# EAGLE design ProbeBoard (EAGLE 9.3.0)

## Sheet 1 of 3: ADC Schematic
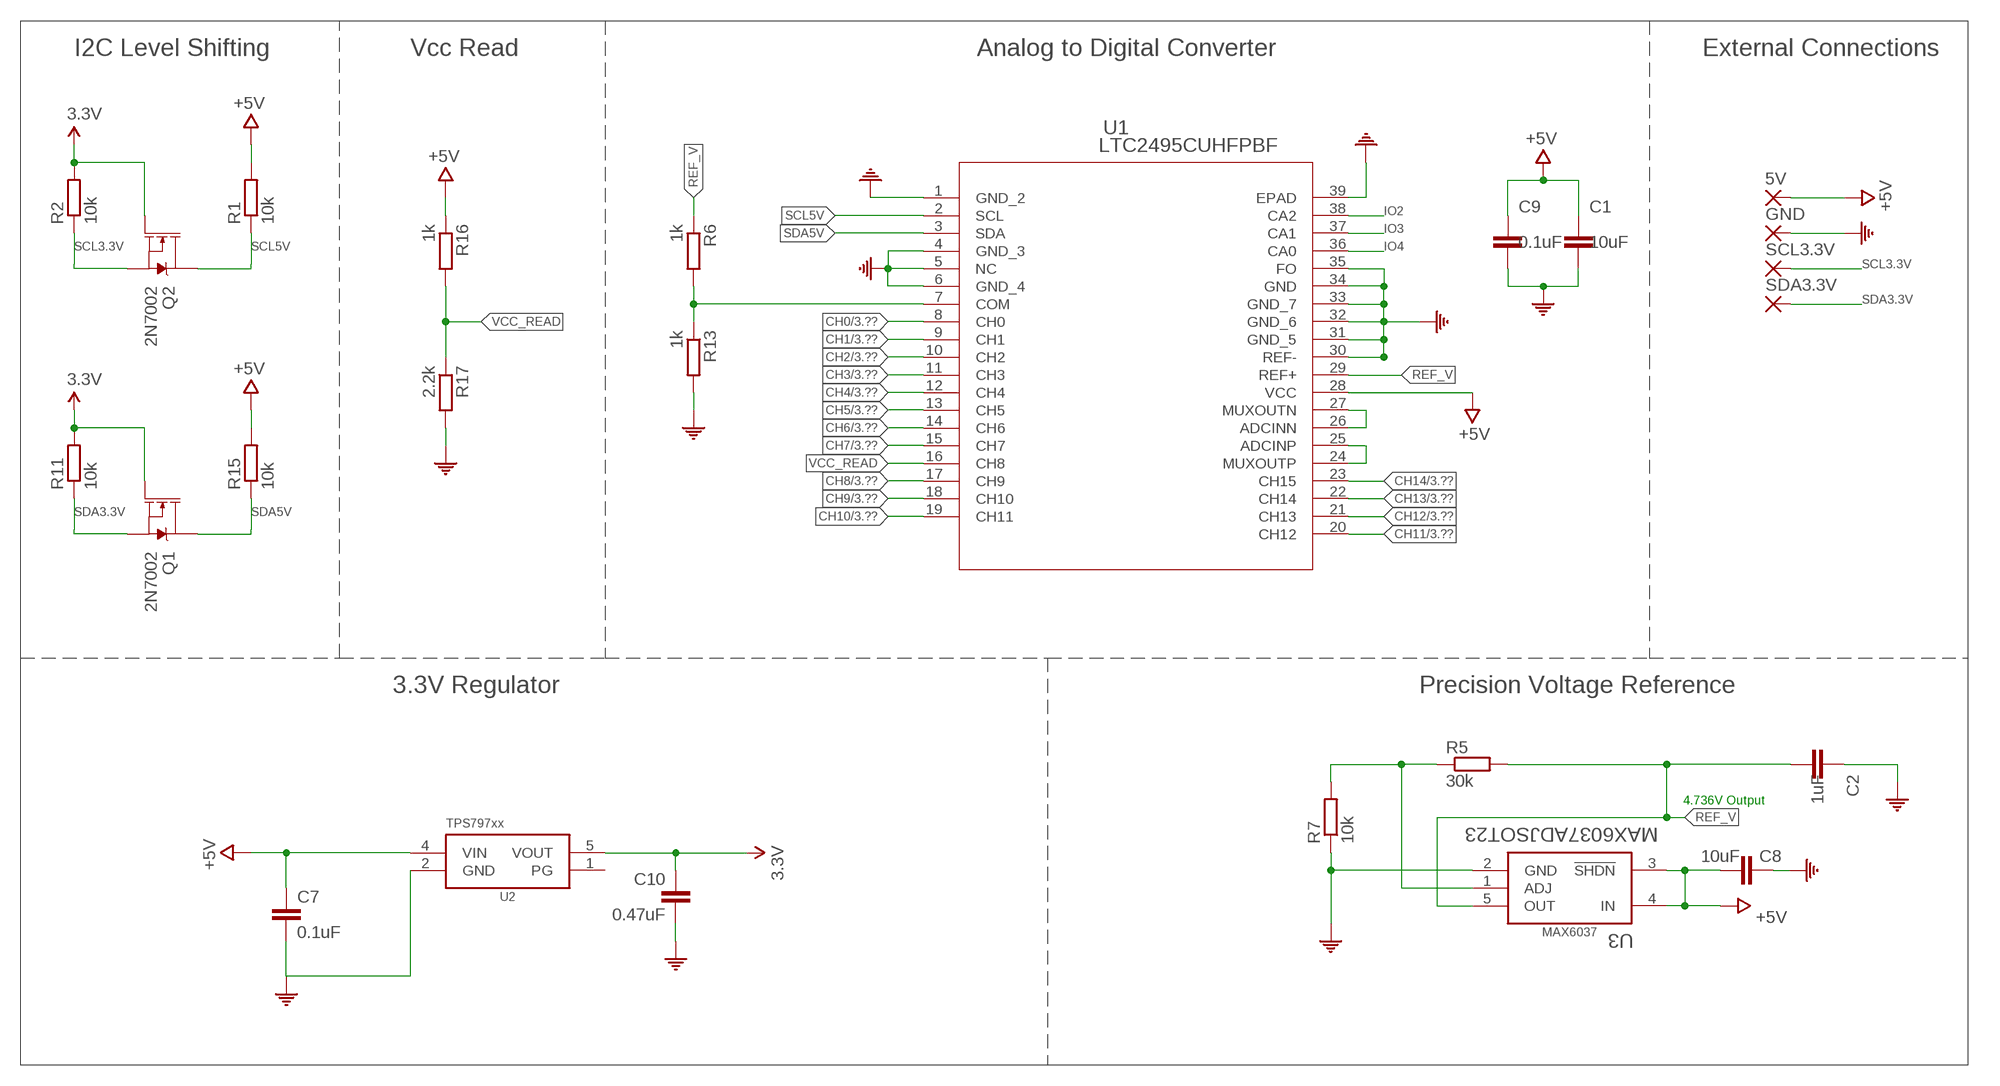
[diagram p0: schematic, sheet 1]

### Parts
5V  1,6/0,9  [1,6/0,9]
C1  10uF  C-EUC0603  [C0603]
C2  1uF  C-EUC0603  [C0603]
C7  0.1uF  C-EUC0603  [C0603]
C8  10uF  C-EUC0603  [C0603]
C9  0.1uF  C-EUC0603  [C0603]
C10  0.47uF  C-EUC0603  [C0603]
GND  1,6/0,9  [1,6/0,9]
Q1  2N7002  MOSFET-NCH-2N7002PW  [SOT323]
Q2  2N7002  MOSFET-NCH-2N7002PW  [SOT323]
R1  10k  R-EU_R0603  [R0603]
R2  10k  R-EU_R0603  [R0603]
R5  30k  R-EU_R0603  [R0603]
R6  1k  R-EU_R0603  [R0603]
R7  10k  R-EU_R0603  [R0603]
R11  10k  R-EU_R0603  [R0603]
R13  1k  R-EU_R0603  [R0603]
R15  10k  R-EU_R0603  [R0603]
R16  1k  R-EU_R0603  [R0603]
R17  2.2k  R-EU_R0603  [R0603]
SCL3.3V  1,6/0,9  [1,6/0,9]
SDA3.3V  1,6/0,9  [1,6/0,9]
U1  LTC2495CUHFPBF  [QFN-38_UHF]
U2  TPS79733  [DCK_R-PDSO-G5]
U3  MAX6037ADJSOT23  [SOT23-5]

### Nets
3.3V: C10.2 Q1.1(G) Q2.1(G) R2.2 R11.2 U2.5(VOUT)
+5V: 5V.1(P) C1.1 C7.1 C8.2 C9.1 R1.2 R15.2 R16.1 U1.28(VCC) U2.4(VIN) U3.3(!SHDN) U3.4(IN) ; also sheet 2,3
CH0: U1.8(CH0) ; also sheet 3
CH1: U1.9(CH1) ; also sheet 3
CH2: U1.10(CH2) ; also sheet 3
CH3: U1.11(CH3) ; also sheet 3
CH4: U1.12(CH4) ; also sheet 3
CH5: U1.13(CH5) ; also sheet 3
CH6: U1.14(CH6) ; also sheet 3
CH7: U1.15(CH7) ; also sheet 3
CH8: U1.17(CH9) ; also sheet 3
CH9: U1.18(CH10) ; also sheet 3
CH10: U1.19(CH11) ; also sheet 3
CH11: U1.20(CH12) ; also sheet 3
CH12: U1.21(CH13) ; also sheet 3
CH13: U1.22(CH14) ; also sheet 3
CH14: U1.23(CH15) ; also sheet 3
COM: C1.2 C2.1 C7.2 C8.1 C9.2 C10.1 GND.1(P) R7.1 R13.2 R17.2 U1.1(GND_2) U1.4(GND_3) U1.5(NC) U1.6(GND_4) U1.30(REF-) U1.31(GND_5) U1.32(GND_6) U1.33(GND_7) U1.34(GND) U1.35(FO) U1.39(EPAD) U2.2(GND) U3.2(GND) ; also sheet 2,3
IO2: U1.38(CA2) ; also sheet 2
IO3: U1.37(CA1) ; also sheet 2
IO4: U1.36(CA0) ; also sheet 2
N$2: U1.26(ADCINN) U1.27(MUXOUTN)
N$3: U1.24(MUXOUTP) U1.25(ADCINP)
N$5: R6.2 R13.1 U1.7(COM)
N$6: R5.1 R7.2 U3.1(ADJ)
REF_V: C2.2 R5.2 R6.1 U1.29(REF+) U3.5(OUT)
SCL3.3V: Q2.2(S) R2.1 SCL3.3V.1(P)
SCL5V: Q2.3(D) R1.1 U1.2(SCL) ; also sheet 2
SDA3.3V: Q1.2(S) R11.1 SDA3.3V.1(P)
SDA5V: Q1.3(D) R15.1 U1.3(SDA) ; also sheet 2
VCC_READ: R16.2 R17.1 U1.16(CH8)
Unconnected: U2.1(PG)

### Notes on the sheet
- I2C Level Shifting | Vcc Read | Analog to Digital Converter | External Connections
- 3.3V Regulator | Precision Voltage Reference
- 4.736V Output

## Sheet 2 of 3: Arduino Schematic
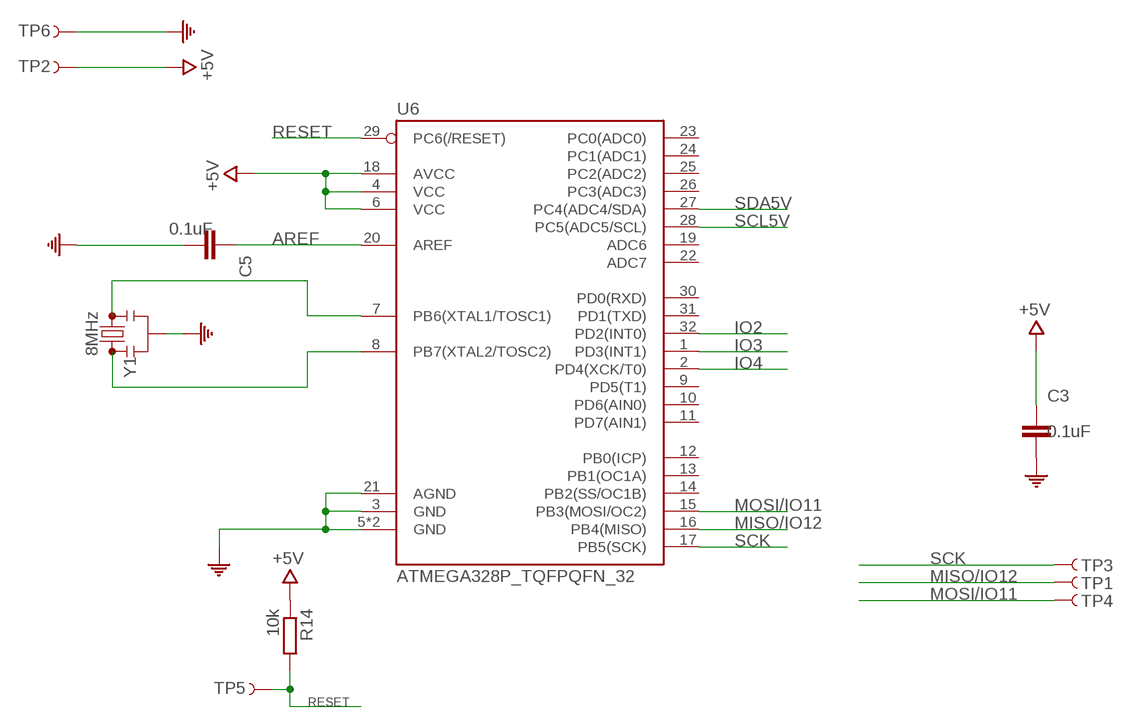
[diagram p1: schematic, sheet 2]

### Parts
C3  0.1uF  C-EUC0603  [C0603]
C5  0.1uF  C-EUC0603  [C0603]
R14  10k  R-EU_R0603  [R0603]
TP1  TEST-POINT3  [PAD.03X.03]
TP2  TEST-POINT3  [PAD.03X.03]
TP3  TEST-POINT3  [PAD.03X.03]
TP4  TEST-POINT3  [PAD.03X.03]
TP5  TEST-POINT3  [PAD.03X.03]
TP6  TEST-POINT3  [PAD.03X.03]
U6  ATMEGA328P_TQFPQFN_32  [QFN32]
Y1  8MHz  RESONATOR8MHZSMD_3.2X1.3  [RESONATOR-SMD-3.2X1.3]

### Nets
+5V: C3.1 R14.1 TP2.P$1 U6.4(VCC) U6.6(VCC) U6.18(AVCC) ; also sheet 1,3
AREF: C5.1 U6.20(AREF)
COM: C3.2 C5.2 TP6.P$1 U6.3(GND) U6.5(GND) U6.21(AGND) U6.EP(GND) Y1.2 ; also sheet 1,3
IO2: U6.32(PD2(INT0)) ; also sheet 1
IO3: U6.1(PD3(INT1)) ; also sheet 1
IO4: U6.2(PD4(XCK/T0)) ; also sheet 1
MISO/IO12: TP1.P$1 U6.16(PB4(MISO))
MOSI/IO11: TP4.P$1 U6.15(PB3(MOSI/OC2))
N$1: U6.7(PB6(XTAL1/TOSC1)) Y1.3
N$7: U6.8(PB7(XTAL2/TOSC2)) Y1.1
RESET: R14.2 TP5.P$1 U6.29(PC6(/RESET))
SCK: TP3.P$1 U6.17(PB5(SCK))
SCL5V: U6.28(PC5(ADC5/SCL)) ; also sheet 1
SDA5V: U6.27(PC4(ADC4/SDA)) ; also sheet 1
Unconnected: U6.9(PD5(T1)) U6.10(PD6(AIN0)) U6.11(PD7(AIN1)) U6.12(PB0(ICP)) U6.13(PB1(OC1A)) U6.14(PB2(SS/OC1B)) U6.19(ADC6) U6.22(ADC7) U6.23(PC0(ADC0)) U6.24(PC1(ADC1)) U6.25(PC2(ADC2)) U6.26(PC3(ADC3)) U6.30(PD0(RXD)) U6.31(PD1(TXD))

## Sheet 3 of 3: Thermistor Connections
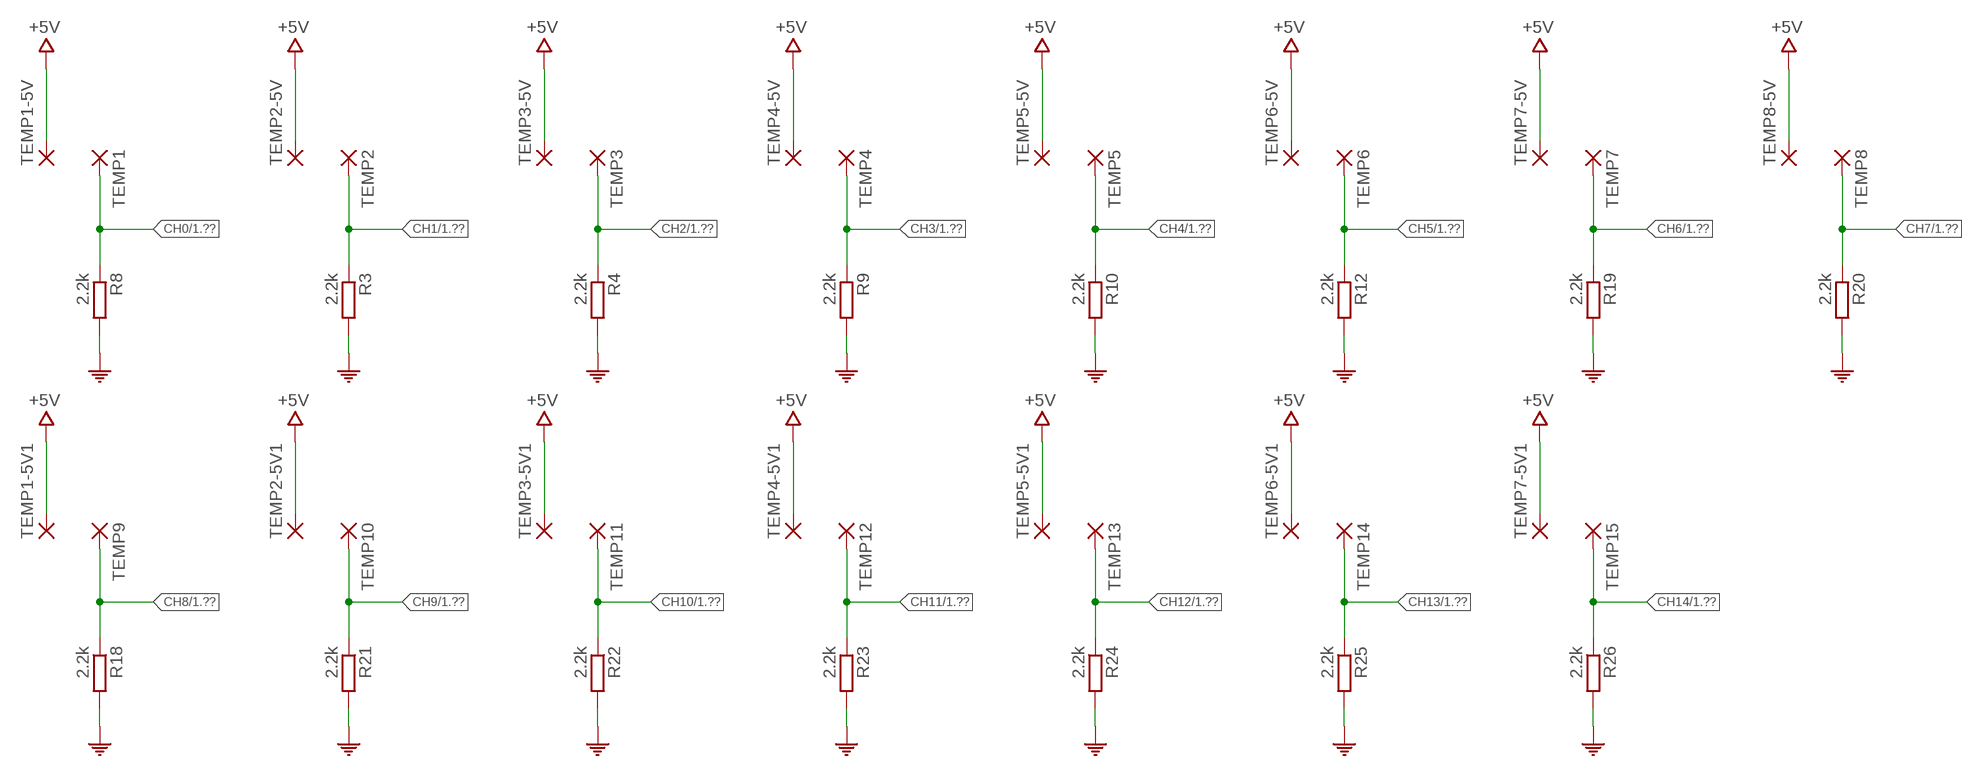
[diagram p2: schematic, sheet 3]

### Parts
R3  2.2k  R-EU_R0603  [R0603]
R4  2.2k  R-EU_R0603  [R0603]
R8  2.2k  R-EU_R0603  [R0603]
R9  2.2k  R-EU_R0603  [R0603]
R10  2.2k  R-EU_R0603  [R0603]
R12  2.2k  R-EU_R0603  [R0603]
R18  2.2k  R-EU_R0603  [R0603]
R19  2.2k  R-EU_R0603  [R0603]
R20  2.2k  R-EU_R0603  [R0603]
R21  2.2k  R-EU_R0603  [R0603]
R22  2.2k  R-EU_R0603  [R0603]
R23  2.2k  R-EU_R0603  [R0603]
R24  2.2k  R-EU_R0603  [R0603]
R25  2.2k  R-EU_R0603  [R0603]
R26  2.2k  R-EU_R0603  [R0603]
TEMP1  1,6/0,9  [1,6/0,9]
TEMP1-5V  1,6/0,9  [1,6/0,9]
TEMP1-5V1  1,6/0,9  [1,6/0,9]
TEMP2  1,6/0,9  [1,6/0,9]
TEMP2-5V  1,6/0,9  [1,6/0,9]
TEMP2-5V1  1,6/0,9  [1,6/0,9]
TEMP3  1,6/0,9  [1,6/0,9]
TEMP3-5V  1,6/0,9  [1,6/0,9]
TEMP3-5V1  1,6/0,9  [1,6/0,9]
TEMP4  1,6/0,9  [1,6/0,9]
TEMP4-5V  1,6/0,9  [1,6/0,9]
TEMP4-5V1  1,6/0,9  [1,6/0,9]
TEMP5  1,6/0,9  [1,6/0,9]
TEMP5-5V  1,6/0,9  [1,6/0,9]
TEMP5-5V1  1,6/0,9  [1,6/0,9]
TEMP6  1,6/0,9  [1,6/0,9]
TEMP6-5V  1,6/0,9  [1,6/0,9]
TEMP6-5V1  1,6/0,9  [1,6/0,9]
TEMP7  1,6/0,9  [1,6/0,9]
TEMP7-5V  1,6/0,9  [1,6/0,9]
TEMP7-5V1  1,6/0,9  [1,6/0,9]
TEMP8  1,6/0,9  [1,6/0,9]
TEMP8-5V  1,6/0,9  [1,6/0,9]
TEMP9  1,6/0,9  [1,6/0,9]
TEMP10  1,6/0,9  [1,6/0,9]
TEMP11  1,6/0,9  [1,6/0,9]
TEMP12  1,6/0,9  [1,6/0,9]
TEMP13  1,6/0,9  [1,6/0,9]
TEMP14  1,6/0,9  [1,6/0,9]
TEMP15  1,6/0,9  [1,6/0,9]

### Nets
+5V: TEMP1-5V1.1(P) TEMP1-5V.1(P) TEMP2-5V1.1(P) TEMP2-5V.1(P) TEMP3-5V1.1(P) TEMP3-5V.1(P) TEMP4-5V1.1(P) TEMP4-5V.1(P) TEMP5-5V1.1(P) TEMP5-5V.1(P) TEMP6-5V1.1(P) TEMP6-5V.1(P) TEMP7-5V1.1(P) TEMP7-5V.1(P) TEMP8-5V.1(P) ; also sheet 1,2
CH0: R8.1 TEMP1.1(P) ; also sheet 1
CH1: R3.1 TEMP2.1(P) ; also sheet 1
CH2: R4.1 TEMP3.1(P) ; also sheet 1
CH3: R9.1 TEMP4.1(P) ; also sheet 1
CH4: R10.1 TEMP5.1(P) ; also sheet 1
CH5: R12.1 TEMP6.1(P) ; also sheet 1
CH6: R19.1 TEMP7.1(P) ; also sheet 1
CH7: R20.1 TEMP8.1(P) ; also sheet 1
CH8: R18.1 TEMP9.1(P) ; also sheet 1
CH9: R21.1 TEMP10.1(P) ; also sheet 1
CH10: R22.1 TEMP11.1(P) ; also sheet 1
CH11: R23.1 TEMP12.1(P) ; also sheet 1
CH12: R24.1 TEMP13.1(P) ; also sheet 1
CH13: R25.1 TEMP14.1(P) ; also sheet 1
CH14: R26.1 TEMP15.1(P) ; also sheet 1
COM: R3.2 R4.2 R8.2 R9.2 R10.2 R12.2 R18.2 R19.2 R20.2 R21.2 R22.2 R23.2 R24.2 R25.2 R26.2 ; also sheet 1,2

## Library data of the parts
5V GND SCL3.3V SDA3.3V TEMP1 TEMP1-5V TEMP1-5V1 TEMP2 TEMP2-5V TEMP2-5V1 TEMP3 TEMP3-5V TEMP3-5V1 TEMP4 TEMP4-5V TEMP4-5V1 TEMP5 TEMP5-5V TEMP5-5V1 TEMP6 TEMP6-5V TEMP6-5V1 TEMP7 TEMP7-5V TEMP7-5V1 TEMP8 TEMP8-5V TEMP9-TEMP15 = wirepad:1,6/0,9: THROUGH-HOLE PAD
C1 C8 = bschulz_passives:C-EU: CAPACITOR, European symbol; DIGIKEY_PART_NUMBER: 445-9104-6-ND; MANUFACTURER: TDK Corporation; MANUFACTURER_PART_NUMBER: C1608X7S0J106M080AC; PRICE: 0.18328
C2 = bschulz_passives:C-EU: CAPACITOR, European symbol; DIGIKEY_PART_NUMBER: 1276-1184-6-ND; MANUFACTURER: Samsung Electro-Mechanics; MANUFACTURER_PART_NUMBER: CL10B105KA8NNNC; PRICE: 0.01719
C3 C5 C7 C9 = bschulz_passives:C-EU: CAPACITOR, European symbol; DIGIKEY_PART_NUMBER: 478-7939-2-ND; MANUFACTURER: AVX Corporation; MANUFACTURER_PART_NUMBER: 0603ZC104KAT2A; PRICE: 0.08325
C10 = bschulz_passives:C-EU: CAPACITOR, European symbol; DIGIKEY_PART_NUMBER: 478-10367-1-ND; MANUFACTURER: AVX Corporation; MANUFACTURER_PART_NUMBER: 0603ZC474KAT2A; PRICE: 0.02904
Q1 Q2 = bschulz:MOSFET-NCH: N-channel MOSFETs Voltage controlled devices that allow control of high current outputs. SparkFun Products: SparkFun OpenScale <https://www.sparkfun.com/products/13261> SparkFun Digital Sandbox <https://www.sparkfun.com/products/12651> SparkFun Monster Moto Shield <https://www.sparkfun.com/products/10182> SparkFun MOSFET Power Controller <https://www.sparkfun.com/products/11214>; DIGIKEY: 2N7002W-FDICT-ND; MF: Diodes Incorporated; MPN: 2N7002W-7-F; PROD_ID: TRANS-11151
R1 R2 R7 R11 R14 R15 = bschulz_passives:R-EU_: RESISTOR, European symbol Digikey Parts: Yageo, 0402 <https://www.digikey.com/products/en/resistors/chip-resistor-surface-mount/52?k=&pkeyword=&sf=0&FV=ffec1104%2Cfffc000d%2C1c0002%2C440067%2C1f140000%2Cffe00034%2C400004&quantity=&ColumnSort=0&page=1&stock=1&pageSize=25> Yageo, 0603 <https://www.digikey.com/products/en/resistors/chip-resistor-surface-mount/52?k=&pkeyword=&s=4356&s=47360&sf=0&FV=fffc000d%2C1c0002%2C142c040c%2C1f140000%2Cffe00034&quantity=10&ColumnSort=1000011&page=1&stock=1&pageSize=25> Panasonic, 0603 <https://www.digikey.com/products/en/resistors/chip-resistor-surface-mount/52?k=&pkeyword=&pv252=68&sf=0&FV=ffec373d%2C1c0002%2C142c040c%2C1f140000%2Cffe00034%2C80002%2Cc0001&quantity=&ColumnSort=0&page=1&stock=1&pageSize=25> Panasonic, precision, 0603 <https://www.digikey.com/products/en/resistors/chip-resistor-surface-mount/52?FV=ffec4907%2Cfffc000a%2Cc0172%2C142c040c%2C1f140000%2Cffe00034%2C1c0002&quantity=100&ColumnSort=2085&page=1&stock=1&pageSize=25> Panasonic, 0805 <https://www.digikey.com/products/en/resistors/chip-resistor-surface-mount/52?k=&pkeyword=&pv3=1&sf=0&FV=ffec373d%2C1c0002%2C1f140000%2Cffe00034%2C142c040d&quantity=&ColumnSort=0&page=1&stock=1&pageSize=25> Rohm, current sense <https://www.digikey.com/products/en/resistors/chip-resistor-surface-mount/52?k=&pkeyword=&pv3=1&sf=0&FV=ffecb688%2C1f140000%2Cffe00034%2C1c0002&quantity=&ColumnSort=0&page=1&stock=1&pageSize=25> Vishay, pulse proof automotive <https://www.digikey.com/products/en/resistors/chip-resistor-surface-mount/52?k=&pkeyword=&pv7=2&sf=0&FV=ffec5d6b%2Cffe00034%2C1f140000&quantity=&ColumnSort=0&page=1&stock=1&pageSize=25>; DIGIKEY_PART_NUMBER: P10KGTR-ND; MANUFACTURER: Panasonic Electronic Components; MANUFACTURER_PART_NUMBER: ERJ-3GEYJ103V; MF: Yageo; PRICE: 0.00494
R3 R4 R8-R10 R12 R17-R26 = bschulz_passives:R-EU_: RESISTOR, European symbol Digikey Parts: Yageo, 0402 <https://www.digikey.com/products/en/resistors/chip-resistor-surface-mount/52?k=&pkeyword=&sf=0&FV=ffec1104%2Cfffc000d%2C1c0002%2C440067%2C1f140000%2Cffe00034%2C400004&quantity=&ColumnSort=0&page=1&stock=1&pageSize=25> Yageo, 0603 <https://www.digikey.com/products/en/resistors/chip-resistor-surface-mount/52?k=&pkeyword=&s=4356&s=47360&sf=0&FV=fffc000d%2C1c0002%2C142c040c%2C1f140000%2Cffe00034&quantity=10&ColumnSort=1000011&page=1&stock=1&pageSize=25> Panasonic, 0603 <https://www.digikey.com/products/en/resistors/chip-resistor-surface-mount/52?k=&pkeyword=&pv252=68&sf=0&FV=ffec373d%2C1c0002%2C142c040c%2C1f140000%2Cffe00034%2C80002%2Cc0001&quantity=&ColumnSort=0&page=1&stock=1&pageSize=25> Panasonic, precision, 0603 <https://www.digikey.com/products/en/resistors/chip-resistor-surface-mount/52?FV=ffec4907%2Cfffc000a%2Cc0172%2C142c040c%2C1f140000%2Cffe00034%2C1c0002&quantity=100&ColumnSort=2085&page=1&stock=1&pageSize=25> Panasonic, 0805 <https://www.digikey.com/products/en/resistors/chip-resistor-surface-mount/52?k=&pkeyword=&pv3=1&sf=0&FV=ffec373d%2C1c0002%2C1f140000%2Cffe00034%2C142c040d&quantity=&ColumnSort=0&page=1&stock=1&pageSize=25> Rohm, current sense <https://www.digikey.com/products/en/resistors/chip-resistor-surface-mount/52?k=&pkeyword=&pv3=1&sf=0&FV=ffecb688%2C1f140000%2Cffe00034%2C1c0002&quantity=&ColumnSort=0&page=1&stock=1&pageSize=25> Vishay, pulse proof automotive <https://www.digikey.com/products/en/resistors/chip-resistor-surface-mount/52?k=&pkeyword=&pv7=2&sf=0&FV=ffec5d6b%2Cffe00034%2C1f140000&quantity=&ColumnSort=0&page=1&stock=1&pageSize=25>; DIGIKEY_PART_NUMBER: P2.2KDBTR-ND; MANUFACTURER: Panasonic Electronic Components; MANUFACTURER_PART_NUMBER: ERA-3AEB222V; MF: Yageo; PRICE: 0.03717
R5 = bschulz_passives:R-EU_: RESISTOR, European symbol Digikey Parts: Yageo, 0402 <https://www.digikey.com/products/en/resistors/chip-resistor-surface-mount/52?k=&pkeyword=&sf=0&FV=ffec1104%2Cfffc000d%2C1c0002%2C440067%2C1f140000%2Cffe00034%2C400004&quantity=&ColumnSort=0&page=1&stock=1&pageSize=25> Yageo, 0603 <https://www.digikey.com/products/en/resistors/chip-resistor-surface-mount/52?k=&pkeyword=&s=4356&s=47360&sf=0&FV=fffc000d%2C1c0002%2C142c040c%2C1f140000%2Cffe00034&quantity=10&ColumnSort=1000011&page=1&stock=1&pageSize=25> Panasonic, 0603 <https://www.digikey.com/products/en/resistors/chip-resistor-surface-mount/52?k=&pkeyword=&pv252=68&sf=0&FV=ffec373d%2C1c0002%2C142c040c%2C1f140000%2Cffe00034%2C80002%2Cc0001&quantity=&ColumnSort=0&page=1&stock=1&pageSize=25> Panasonic, precision, 0603 <https://www.digikey.com/products/en/resistors/chip-resistor-surface-mount/52?FV=ffec4907%2Cfffc000a%2Cc0172%2C142c040c%2C1f140000%2Cffe00034%2C1c0002&quantity=100&ColumnSort=2085&page=1&stock=1&pageSize=25> Panasonic, 0805 <https://www.digikey.com/products/en/resistors/chip-resistor-surface-mount/52?k=&pkeyword=&pv3=1&sf=0&FV=ffec373d%2C1c0002%2C1f140000%2Cffe00034%2C142c040d&quantity=&ColumnSort=0&page=1&stock=1&pageSize=25> Rohm, current sense <https://www.digikey.com/products/en/resistors/chip-resistor-surface-mount/52?k=&pkeyword=&pv3=1&sf=0&FV=ffecb688%2C1f140000%2Cffe00034%2C1c0002&quantity=&ColumnSort=0&page=1&stock=1&pageSize=25> Vishay, pulse proof automotive <https://www.digikey.com/products/en/resistors/chip-resistor-surface-mount/52?k=&pkeyword=&pv7=2&sf=0&FV=ffec5d6b%2Cffe00034%2C1f140000&quantity=&ColumnSort=0&page=1&stock=1&pageSize=25>; DIGIKEY_PART_NUMBER: P30KGDKR-ND; MANUFACTURER: Panasonic Electronic Components; MANUFACTURER_PART_NUMBER: ERJ-3GEYJ303V; MF: Yageo; PRICE: 0.00758
R6 R13 R16 = bschulz_passives:R-EU_: RESISTOR, European symbol Digikey Parts: Yageo, 0402 <https://www.digikey.com/products/en/resistors/chip-resistor-surface-mount/52?k=&pkeyword=&sf=0&FV=ffec1104%2Cfffc000d%2C1c0002%2C440067%2C1f140000%2Cffe00034%2C400004&quantity=&ColumnSort=0&page=1&stock=1&pageSize=25> Yageo, 0603 <https://www.digikey.com/products/en/resistors/chip-resistor-surface-mount/52?k=&pkeyword=&s=4356&s=47360&sf=0&FV=fffc000d%2C1c0002%2C142c040c%2C1f140000%2Cffe00034&quantity=10&ColumnSort=1000011&page=1&stock=1&pageSize=25> Panasonic, 0603 <https://www.digikey.com/products/en/resistors/chip-resistor-surface-mount/52?k=&pkeyword=&pv252=68&sf=0&FV=ffec373d%2C1c0002%2C142c040c%2C1f140000%2Cffe00034%2C80002%2Cc0001&quantity=&ColumnSort=0&page=1&stock=1&pageSize=25> Panasonic, precision, 0603 <https://www.digikey.com/products/en/resistors/chip-resistor-surface-mount/52?FV=ffec4907%2Cfffc000a%2Cc0172%2C142c040c%2C1f140000%2Cffe00034%2C1c0002&quantity=100&ColumnSort=2085&page=1&stock=1&pageSize=25> Panasonic, 0805 <https://www.digikey.com/products/en/resistors/chip-resistor-surface-mount/52?k=&pkeyword=&pv3=1&sf=0&FV=ffec373d%2C1c0002%2C1f140000%2Cffe00034%2C142c040d&quantity=&ColumnSort=0&page=1&stock=1&pageSize=25> Rohm, current sense <https://www.digikey.com/products/en/resistors/chip-resistor-surface-mount/52?k=&pkeyword=&pv3=1&sf=0&FV=ffecb688%2C1f140000%2Cffe00034%2C1c0002&quantity=&ColumnSort=0&page=1&stock=1&pageSize=25> Vishay, pulse proof automotive <https://www.digikey.com/products/en/resistors/chip-resistor-surface-mount/52?k=&pkeyword=&pv7=2&sf=0&FV=ffec5d6b%2Cffe00034%2C1f140000&quantity=&ColumnSort=0&page=1&stock=1&pageSize=25>; DIGIKEY_PART_NUMBER: P1.0KDBDKR-ND; MANUFACTURER: Panasonic Electronic Components; MANUFACTURER_PART_NUMBER: ERA-3AEB102V; MF: Yageo; PRICE: 0.04906
TP1-TP6 = SparkFun-Passives:TEST-POINT: Bare copper test points for troubleshooting or ICT
U1 = LTC2495:LTC2495CUHFPBF; DIGIKEY_PART_NUMBER: LTC2495IUHF#PBF-ND; MANUFACTURER: Linear Technology/Analog Devices; MANUFACTURER_PART_NUMBER: LTC2495CUHF#PBF; PRICE: 5.11040; VENDOR: Linear Technology
U2 = bschulz:TPS797*: TPS797* - Ultra Low Power Low Dropout Linear Regulator Characteristics: Vin: 1.4V ~ 5.5V Vout: 1.8, 2.85, 3.0, 3.3V fixed IQ: 1.2μA typ, 2μA max Voltage Accuracy: 4% max Dropout Voltage: 105mV @ 10mA Output Current: 50 mA Operating Temperature: -40°C to 85°C Digikey: TPS79733 (3.3V Fixed) <https://www.digikey.com/product-detail/en/texas-instruments/TPS79733DCKR/296-11990-1-ND/390520> TPS79730 (3.0V Fixed) <https://www.digikey.com/product-detail/en/texas-instruments/TPS79730DCKR/296-11989-1-ND/390518> TPS797285 (2.85V Fixed) <https://www.digikey.com/product-detail/en/texas-instruments/TPS797285DCKR/296-25465-1-ND/2187585> TPS79718 (1.8V Fixed) <https://www.digikey.com/product-detail/en/texas-instruments/TPS79718DCKR/296-11988-1-ND/390516>; DIGIKEY: 296-11990-1-ND; MF: TI; MPN: TPS79733DCKR
U3 = bschulz:MAX6037: MAX6037 - Low Power Voltage Referance with Shutdown Characteristics: Vin: 2.5V ~ 5.5V Vout: 1.184V ~ 5V IQ: 190μA Iout: 5mA Tolerance: ± 0.3% Operating Temperature: -40°C to 125°C Digikey: MAX6037BAUKADJ (Adjustable) <https://www.digikey.com/product-detail/en/maxim-integrated/MAX6037BAUKADJ-T/MAX6037BAUKADJ-TCT-ND/5821111>; DIGIKEY: MAX6037BAUKADJ+TCT-ND; DIGIKEY_PART_NUMBER: MAX6037AAUK33+TCT-ND; MANUFACTURER: Maxim Integrated; MF: Maxim; MPN: MAX6037BAUKADJ+T; PRICE: 2.59488
U6 = bschulz:ATMEGA328P_TQFP: Popular 328P in QFP Storefront component: ATmega328 - TQFP <https://www.sparkfun.com/products/13448> (COM-13448) Datasheet <http://www.sparkfun.com/datasheets/Components/SMD/ATMega328.pdf> SparkFun Products SparkFun RedBoard - Programmed with Arduino <https://www.sparkfun.com/products/12757> (DEV-12757) Arduino Pro Mini 328 - 5V/16MHz <https://www.sparkfun.com/products/11113> (DEV-11113) Arduino Pro Mini 328 - 3.3V/8MHz <https://www.sparkfun.com/products/11114> (DEV-11114) SparkFun OpenLog <https://www.sparkfun.com/products/13712> (DEV-13712) SparkFun MicroView - OLED Arduino Module <https://www.sparkfun.com/products/12923> (DEV-12923) SparkFun Digital Sandbox <https://www.sparkfun.com/products/12651> (DEV-12651) SparkFun PicoBoard <https://www.sparkfun.com/products/11888> (WIG-11888) Arduino Fio <https://www.sparkfun.com/products/10116> (DEV-10116) LilyPad Arduino 328 Main Board <https://www.sparkfun.com/products/13342> (DEV-13342) SparkFun RedStick <https://www.sparkfun.com/products/13741> (DEV-13741) LilyPad MP3 <https://www.sparkfun.com/products/11013> (DEV-11013) LilyPad Arduino SimpleSnap <https://www.sparkfun.com/products/10941> (DEV-10941) SparkFun Stepoko <https://www.sparkfun.com/products/13899> (ROB-13899) SparkFun Geiger Counter <https://www.sparkfun.com/products/11345> (SEN-11345) SparkFun EL Sequencer <https://www.sparkfun.com/products/12781> (COM-12781) Arduino Pro 328 - 5V/16MHz <https://www.sparkfun.com/products/10915> (DEV-10915) CryptoCape <https://www.sparkfun.com/products/12773> (DEV-12773) SparkFun IR Thermometer Evaluation Board - MLX90614 <https://www.sparkfun.com/products/10740> (SEN-10740) SparkFun RedBot Mainboard <https://www.sparkfun.com/products/12097> (ROB-12097) Arduino Pro 328 - 3.3V/8MHz <https://www.sparkfun.com/products/10914> (DEV-10914) SparkFun Block for Intel® Edison - Arduino <https://www.sparkfun.com/products/13036> (DEV-13036) SparkFun Simon Says - Surface Mount Soldering Kit <https://www.sparkfun.com/products/10935> (KIT-10935) SparkFun 7-Segment Serial Display - Red <https://www.sparkfun.com/products/11441> (COM-11441) SparkFun 7-Segment Serial Display - White <https://www.sparkfun.com/products/11629> (COM-11629) SparkFun 7-Segment Serial Display - Yellow <https://www.sparkfun.com/products/11443> (COM-11443) SparkFun 7-Segment Serial Display - Kelly Green <https://www.sparkfun.com/products/11440> (COM-11440) SparkFun 7-Segment Serial Display - Blue <https://www.sparkfun.com/products/11442> (COM-11442) SparkFun OpenSegment Serial Display - 20mm (Blue) <https://www.sparkfun.com/products/11647> (COM-11647) SparkFun OpenSegment Serial Display - 20mm (Green) <https://www.sparkfun.com/products/11646> (COM-11646) SparkFun OpenSegment Serial Display - 20mm (White) <https://www.sparkfun.com/products/11648> (COM-11648) SparkFun OpenSegment Serial Display - 20mm (Red) <https://www.sparkfun.com/products/11644> (COM-11644) SparkFun OpenSegment Serial Display - 20mm (Yellow) <https://www.sparkfun.com/products/11645> (COM-11645) SparkFun OpenSegment Shield <https://www.sparkfun.com/products/13190> (DEV-13190); DIGIKEY: ATMEGA328P-MURCT-ND; MF: Atmel; MPN: ATMEGA328P-MUR
Y1 = bschulz:RESONATOR: 16MHz Resonator Digikey Example <http://www.digikey.com/product-detail/en/murata-electronics-north-america/CSTCE16M0V53-R0/490-1198-1-ND/584635> Frequency: 16MHz Frequency Stability: ±0.3% Frequency Tolerance: ±0.5% Capacitance: 15pF SparkFun Products SparkFun OpenLog <https://www.sparkfun.com/products/13712> SparkFun MicroView - OLED Arduino Module <https://www.sparkfun.com/products/12923>; DIGIKEY: 490-17960-1-ND; MF: Murata; MPN: CSTNE8M00G55Z000R0

## Net classes
0 default: width 0.203 mm

## Board
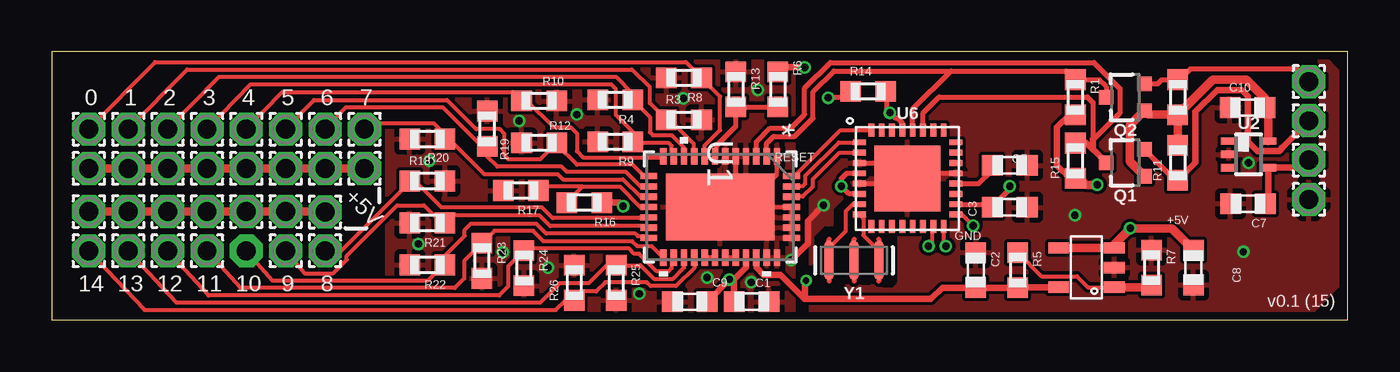
[diagram p3: board, top side]
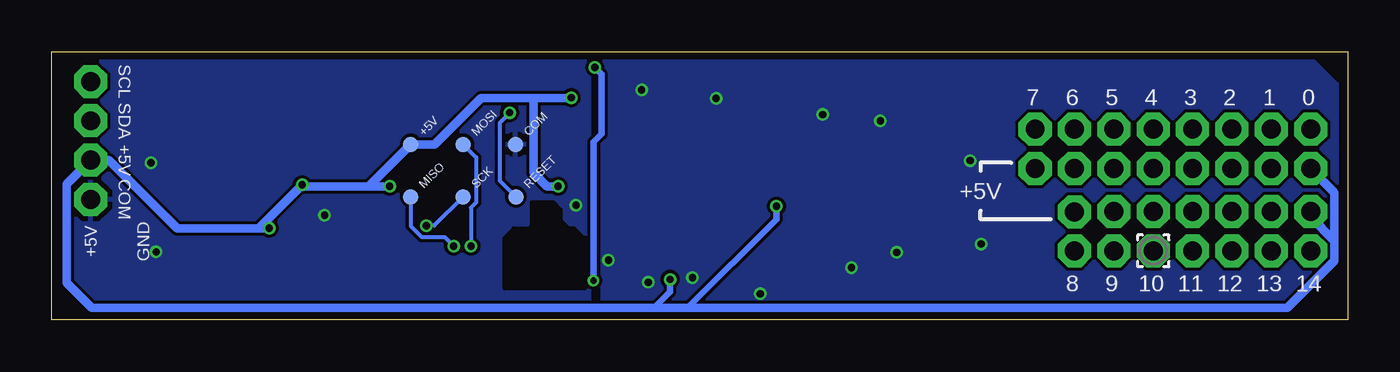
[diagram p4: board, bottom side, seen from below]

Size 62.74 x 13 mm. Coordinates in mm from the lower left corner, seen from the top.
Outline: 0,0 62.74,0 62.74,13.01 0,13.01 0,0
Copper layers (1*16): Top 0.035559375mm / dielectric 1.6mm / Bottom 0.035559375mm
Design rules "oshpark-2layer": minimum track width 6mil, minimum drill 10mil, track to track 6mil, track to pad 6mil, pad to pad 6mil, via to via 6mil, smd to smd 6mil, copper to edge 15mil, drill to drill 6mil, minimum pad ring 5mil, minimum via ring 5mil, stop-mask expansion 2.5mil, vias tented up to drill 0mil, thermal gap 10mil
tRestrict: area 36.7,1.4 to 38.4,4; area 37,3.7 to 38.6,5.7; area 39.2,1.8 to 39.6,3.8; area 40.3,1.7 to 40.8,4; area 38.7,4.2 to 39,4.7
bRestrict: area 37,1.5 to 40.8,5.7

### Footprints (pad centres in the part's own frame; a part is rotated, then mirrored left to right if it is on the bottom)
1,6/0,9 = drill 0.914 pad 1.6 octagon: 1 0,0
C0603 = smd 1 x 1: 1 -0.85,0; 2 0.85,0
SOT323 = smd 0.7 x 0.7: 1 -0.65,-0.925; 2 0.65,-0.925; 3 0,0.925
R0603 = smd 1 x 1: 1 -0.85,0; 2 0.85,0
PAD.03X.03 = smd 0.762 x 0.762: P$1 0,0
QFN-38_UHF = smd 0.805 x 0.3: 1 -2.452,2.75; 2 -2.452,2.25; 3 -2.452,1.75; 4 -2.452,1.25; 5 -2.452,0.75; 6 -2.452,0.25; 7 -2.452,-0.25; 8 -2.452,-0.75; 9 -2.452,-1.25; 10 -2.452,-1.75; 11 -2.452,-2.25; 12 -2.452,-2.75; 20 2.452,-2.75; 21 2.452,-2.25; 22 2.452,-1.75; 23 2.452,-1.25; 24 2.452,-0.75; 25 2.452,-0.25; 26 2.452,0.25; 27 2.452,0.75; 28 2.452,1.25; 29 2.452,1.75; 30 2.452,2.25; 31 2.452,2.75 | smd 0.3 x 0.805: 13 -1.5,-3.452; 14 -1,-3.452; 15 -0.5,-3.452; 16 0,-3.452; 17 0.5,-3.452; 18 1,-3.452; 19 1.5,-3.452; 32 1.5,3.452; 33 1,3.452; 34 0.5,3.452; 35 0,3.452; 36 -0.5,3.452; 37 -1,3.452; 38 -1.5,3.452 | smd 3.25 x 5.25: 39 0,0
DCK_R-PDSO-G5 = smd 0.35 x 0.8: 1 -0.65,-0.95; 2 0,-0.95; 3 0.65,-0.95; 4 0.65,0.95; 5 -0.65,0.95
SOT23-5 = smd 0.55 x 1: 1 -0.95,-1.35; 2 0,-1.35; 3 0.95,-1.35; 4 0.95,1.35; 5 -0.95,1.35
QFN32 = smd 0.63 x 0.28: 1 -2.335,1.75; 2 -2.335,1.25; 3 -2.335,0.75; 4 -2.335,0.25; 5 -2.335,-0.25; 6 -2.335,-0.75; 7 -2.335,-1.25; 8 -2.335,-1.75; 17 2.335,-1.75; 18 2.335,-1.25; 19 2.335,-0.75; 20 2.335,-0.25; 21 2.335,0.25; 22 2.335,0.75; 23 2.335,1.25; 24 2.335,1.75 | smd 0.28 x 0.63: 9 -1.75,-2.335; 10 -1.25,-2.335; 11 -0.75,-2.335; 12 -0.25,-2.335; 13 0.25,-2.335; 14 0.75,-2.335; 15 1.25,-2.335; 16 1.75,-2.335; 25 1.75,2.335; 26 1.25,2.335; 27 0.75,2.335; 28 0.25,2.335; 29 -0.25,2.335; 30 -0.75,2.335; 31 -1.25,2.335; 32 -1.75,2.335 | smd 3.2 x 3.2: EP 0,0
RESONATOR-SMD-3.2X1.3 = smd 0.45 x 1.905: 1 -1.2,0; 2 0,0; 3 1.2,0

### Placement (x,y rotation side)
5V  60.86,7.75 180 top
C1  33.88,0.89 0 top
C2  44.73,2.41 270 top
C3  46.38,5.46 0 top
C5  46.38,7.49 0 top
C7  57.91,5.64 180 top
C8  55.27,2.54 90 top
C9  30.89,0.89 180 top
C10  57.89,10.29 0 top
GND  60.86,5.84 180 top
Q1  51.97,7.62 90 top
Q2  51.97,10.79 90 top
R1  49.56,10.79 270 top
R2  54.51,10.79 270 top
R3  30.61,9.7 0 top
R4  27.28,10.67 180 top
R5  46.76,2.41 270 top
R6  35.15,11.18 270 top
R7  53.24,2.54 270 top
R8  30.61,11.73 180 top
R9  27.28,8.64 180 top
R10  23.6,10.62 0 top
R11  54.51,7.62 90 top
R12  23.6,8.59 180 top
R13  33.12,11.18 90 top
R14  39.52,11.07 0 top
R15  49.56,7.72 270 top
R16  25.78,5.69 180 top
R17  22.71,6.27 180 top
R18  18.19,6.73 0 top
R19  21.08,9.27 90 top
R20  18.19,8.76 180 top
R21  18.19,4.7 180 top
R22  18.19,2.67 180 top
R23  20.83,2.87 270 top
R24  22.86,2.51 270 top
R25  27.33,1.8 270 top
R26  25.3,1.8 90 top
SCL3.3V  60.86,11.56 180 top
SDA3.3V  60.86,9.65 180 top
TEMP1  1.8,9.25 0 top
TEMP1-5V  7.52,7.34 0 top
TEMP1-5V1  1.8,5.26 0 top
TEMP2  3.71,9.25 180 top
TEMP2-5V  1.8,7.34 0 top
TEMP2-5V1  11.33,7.34 0 top
TEMP3  5.61,9.25 0 top
TEMP3-5V  5.61,5.26 0 top
TEMP3-5V1  13.23,5.23 0 top
TEMP4  7.52,9.25 0 top
TEMP4-5V  3.71,7.34 0 top
TEMP4-5V1  15.14,7.34 0 top
TEMP5  9.42,9.25 0 top
TEMP5-5V  3.71,5.26 0 top
TEMP5-5V1  9.42,5.26 0 top
TEMP6  11.33,9.25 0 top
TEMP6-5V  5.61,7.34 0 top
TEMP6-5V1  7.52,5.26 0 top
TEMP7  13.23,9.25 0 top
TEMP7-5V  9.42,7.34 0 top
TEMP7-5V1  11.33,5.26 0 top
TEMP8  15.14,9.25 0 top
TEMP8-5V  13.23,7.34 0 top
TEMP9  13.23,3.35 0 top
TEMP10  11.33,3.35 0 top
TEMP11  9.42,3.35 0 bottom
TEMP12  7.52,3.35 0 top
TEMP13  5.61,3.35 0 top
TEMP14  3.71,3.35 0 top
TEMP15  1.8,3.35 0 top
TP1  45.36,5.97 180 bottom
TP2  45.36,8.51 270 bottom
TP3  42.82,5.97 180 bottom
TP4  42.82,8.51 180 bottom
TP5  40.27,5.97 180 bottom
TP6  40.28,8.51 180 bottom
U1  32.36,5.47 270 top
U2  57.94,8.03 270 top
U3  50.09,2.54 90 top
U6  41.43,6.86 0 top
Y1  38.84,2.9 180 top

### Tracks (layer width: path | path; a pad name or v marks a point on that pad's centre or on a via)
3.3V
  Top 0.305: 54.58,9.95 R2.2
  Top 0.406: R2.2 R11.2 | U2.5 58.89,10.14 C10.2 58.74,10.74 57.82,11.65 56.21,11.65 54.86,10.3 R2.2 | R2.2 53.09,9.95 Q2.1 52.19,9.44 52.19,7.68 Q1.1
+5V  (via drill 0.35)
  Top 0.254: 45.64,5.61 46.38,6.35 v46.38,6.48 | 45.64,5.61 45.51,5.48 C3.1 | U6.18 45.64,5.61 | U6.6 38.6,6.11 v38.23,6.48 38.23,6.86 38.48,7.11 U6.4 | R14.1 38.37,10.77 v37.59,10.77
  Top 0.305: R15.2 49.29,6.87 48.67,7.49 48.67,9.34 49.28,9.95 R1.2 | U1.28 33.61,2.54 33.03,1.96 | C7.1 58.72,5.68 58.89,5.85 U2.4 60.49,7.38 5V.1 | 33.03,1.96 C1.1 | C9.1 v32.81,1.96 33.03,1.96 | R16.1 27.48,5.69 v27.66,5.51
  Top 0.406: C8.2 54.22,4.45 v52.21,4.45 51.44,3.67 U3.3 U3.4 | TEMP1-5V1.1 TEMP5-5V.1 TEMP3-5V.1 TEMP6-5V1.1 TEMP5-5V1.1 TEMP7-5V1.1 13.21,5.26 TEMP3-5V1.1 | TEMP2-5V.1 TEMP4-5V.1 TEMP6-5V.1 TEMP1-5V.1 TEMP7-5V.1 TEMP2-5V1.1 TEMP8-5V.1 TEMP4-5V1.1 | R15.2 49.77,6.87 50.09,6.55 v50.62,6.55
  Bottom 0.305: v32.81,1.96 32.81,1.35 33.58,0.58 | v27.66,5.51 27.66,4.88 31.95,0.58
  Bottom 0.406: v46.38,6.48 47.37,6.48 | 47.37,6.48 50.55,6.48 v50.62,6.55 52.72,4.45 | 39.42,10.75 37.61,10.75 v37.59,10.77 | v38.23,6.48 38.76,6.48 39.42,7.14 39.42,10.75 | 52.72,4.45 56.67,4.45 59.97,7.75 5V.1 62.01,6.59 62.01,1.79 60.81,0.58 33.58,0.58 31.95,0.58 2.94,0.58 0.65,2.87 0.65,3.83 | 52.72,4.45 v52.21,4.45 | TEMP1-5V1.1 1.8,4.99 0.65,3.83 | TEMP2-5V.1 0.65,6.18 0.65,3.83 | 39.42,10.75 41.95,10.75 44.2,8.51 TP2.P$1 47.37,6.5 47.37,6.48
AREF
  Top 0.254: C5.1 45.53,7.28 44.86,6.61 U6.20
CH0
  Top 0.203: U1.8 31.61,8.45 32.36,9.2 32.36,10.83 R8.1 30.7,12.5 5,12.5 TEMP1.1
CH1
  Top 0.203: U1.9 31.09,7.95 31.09,8.53 29.92,9.7 R3.1 28.95,10.51 28.95,11.28 28.09,12.14 6.55,12.14 TEMP2.1
CH2
  Top 0.203: U1.10 30.61,8.36 30.02,8.95 29.1,8.95 28.95,9.1 28.95,9.83 28.13,10.66 R4.1 28.13,10.97 27.32,11.79 8.1,11.79 TEMP3.1
CH3
  Top 0.203: U1.11 30.01,8.02 30.01,8.43 29.85,8.59 28.17,8.59 R9.1 28.13,9.12 27.31,9.94 27.31,11.2 27.09,11.42 9.64,11.42 TEMP4.1
CH4
  Top 0.203: U1.12 29.57,7.88 25.72,7.88 25.43,8.18 25.43,9.04 25.13,9.34 24.29,9.34 23.01,10.62 R10.1 22.32,11.04 11.17,11.04 TEMP5.1
CH5
  Top 0.203: U1.13 28.68,6.97 28.13,7.53 25.42,7.53 24.45,8.5 R12.1 23.64,7.78 22.12,7.78 21.92,7.98 21.92,9.02 21.7,9.24 20.55,9.24 19.13,10.66 12.7,10.66 TEMP6.1
CH6
  Top 0.203: U1.14 28.5,6.47 27.8,7.17 24.95,7.17 24.69,7.42 21.58,7.42 21.08,7.93 R19.1 20.81,8.42 18.93,10.3 14.24,10.3 TEMP7.1
CH7
  Top 0.203: U1.15 28.49,5.97 27.65,6.82 24.75,6.82 24.49,7.07 20.93,7.07 19.24,8.76 R20.1 19.04,8.99 18.5,9.53 15.34,9.53 TEMP8.1
CH8
  Top 0.203: U1.17 28.49,4.97 28.45,4.94 24.25,4.94 23.72,5.47 18.85,5.47 17.59,6.73 R18.1 17.34,6.67 14.02,3.35 TEMP9.1
CH9
  Top 0.203: U1.18 28.82,4.56 24.13,4.56 23.63,5.05 19.39,5.05 R21.1 18.87,4.7 18.02,5.55 16.73,5.55 14.29,3.11 14.29,2.92 13.63,2.26 12.24,2.26 TEMP10.1
CH10
  Top 0.203: U1.19 28.81,4.07 28.37,4.07 28.25,4.19 23.94,4.19 23.46,4.68 20.3,4.68 19.99,4.37 19.99,4.08 19.04,3.12 R22.1 18.95,2.67 18.19,1.91 10.69,1.91 TEMP11.1
CH11
  Top 0.203: U1.20 29.05,3.57 28.35,3.57 28.11,3.81 23.82,3.81 23.31,4.32 21.43,4.32 R23.1 19.97,2.86 19.97,2.01 19.51,1.55 9.14,1.55 TEMP12.1
CH12
  Top 0.203: U1.21 30.01,2.92 30.01,2.51 29.86,2.37 29.29,2.37 28.44,3.21 28.2,3.21 27.96,3.46 22.95,3.46 R24.1 22.1,2.61 22.1,1.63 21.66,1.19 7.59,1.19 TEMP13.1
CH13
  Top 0.203: U1.22 30.61,2.54 30.07,2 29.15,2 28.5,2.65 R25.1 26.86,2.65 26,1.8 24.61,1.8 23.65,0.84 6.04,0.84 TEMP14.1
CH14
  Top 0.203: U1.23 31.11,2.54 30.22,1.64 28.99,1.64 28.8,1.83 26.8,1.83 26.35,1.39 25.73,1.39 R26.1 24.87,0.95 24.4,0.48 4.5,0.48 TEMP15.1
COM  (via drill 0.35)
  Top 0.203: U1.1 35.11,7.02 33.57,5.47 U1.39 | U1.32 U1.35 U1.39 | U1.39 33.31,5.47 34.19,6.35
  Top 0.254: U1.5 33.11,6.16 33.55,5.71 33.76,5.92 34.19,6.35 | U6.5 41.18,6.61 U6.EP | U6.21 41.68,7.11 U6.EP | U6.3 40.68,7.61 U6.EP
  Top 0.305: v37.36,5.56 36.6,4.8 36.6,3.71 v35.79,2.9 | 33.86,1.76 v33.86,1.83
  Top 0.406: U1.39 32.8,5.92 33.76,5.92
  other vias: 57.68,3.3 57.94,7.62 30.58,10.74 25.43,9.96 22.63,9.65 28.45,1.27 24.03,2.54 21.84,3.28 17.75,3.68 18.29,7.72 34.19,11.15 31.72,2.06 49.53,5.08
  pour Bottom: 36.09,0.38 36.09,12.65 1.7,12.65 0.51,11.46 0.51,2.84 2.97,0.38
  pour Bottom: 36.73,12.7 36.73,0.38 60.99,0.38 62.26,1.65 62.26,12.06 61.62,12.7
  pour Top: 36.73,12.7 36.73,0.38 60.99,0.38 62.26,1.65 62.26,12.06 61.62,12.7
  pour Top: 35.94,12.6 16.21,12.6 16.21,0.36 35.94,0.36
IO2
  Top 0.203: U6.32 38.18,9.19 35.96,6.97 U1.38
IO3
  Top 0.203: U6.1 38.1,8.61 36.48,6.98 36.48,6.61 36.35,6.48 U1.37
IO4
  Top 0.203: U6.2 39.07,8.09 38.11,8.09 36.83,6.81 36.83,6.45 36.35,5.97 U1.36
MISO/IO12  (via drill 0.35)
  Top 0.203: v43.28,3.58 43.18,3.58 U6.16
  Bottom 0.203: v43.28,3.58 43.72,4.02 44.83,4.02 45.36,4.55 TP1.P$1
MOSI/IO11  (via drill 0.35)
  Top 0.203: v42.44,3.58 42.63,3.77 42.63,4.48 U6.15
  Bottom 0.203: v42.44,3.58 42.44,5.45 42.19,5.71 42.19,7.87 TP4.P$1
N$1
  Top 0.203: U6.7 38.77,5.6 38.43,5.26 38.43,4.29 37.64,3.5 Y1.3
N$2
  Top 0.254: U1.26 U1.27
N$3
  Top 0.254: U1.24 U1.25
N$5
  Top 0.203: U1.7 32.18,8
  Top 0.254: 32.18,8 32.18,8.44 33.12,9.39 R13.1 R6.2
N$6
  Top 0.203: U3.1 50.17,1.59 49.63,2.12 47.9,2.12 R5.1
  Top 0.406: U3.1 53.14,1.59 R7.2
N$7
  Top 0.203: U6.8 39.28,4.92 39.28,4.1 40.04,3.35 Y1.1
REF_V  (via drill 0.3, 0.35)
  Top 0.305: U3.5 46.79,1.59 R5.2 C2.2 43.12,1.56 42.57,1.02 36.47,1.02 | U1.29 34.11,2.54 34.46,2.19 35.27,2.19 36.44,1.02 36.47,1.02 | v36.45,12.24 35.37,12.24 R6.1 | v36.52,1.91 36.47,1.86 36.47,1.02
  Bottom 0.305: v36.52,1.91 36.52,8.62 36.12,9.02 36.12,11.91 v36.45,12.24
RESET  (via drill 0.35)
  Top 0.254: 40.37,10.83 R14.2 40.44,11.01 40.44,10.19 v40.58,10.05 40.84,9.79 40.93,9.79 41.18,9.54 U6.29
  Bottom 0.203: TP5.P$1 41.05,6.74 41.05,9.56 40.58,10.03 v40.58,10.05
SCK  (via drill 0.35)
  Top 0.203: v44.6,4.57 v44.59,4.57 44.05,5.11 U6.17
  Bottom 0.203: v44.6,4.57 44.22,4.57 TP3.P$1
SCL3.3V
  Top 0.254: SCL3.3V.1 60.26,12.16 55.12,12.16 54.6,11.64 R2.1 53.75,11.64 53.55,11.45 Q2.2
SCL5V
  Top 0.254: U1.2 34.61,8.55 34.95,8.89 35.97,8.89 36.85,9.78 36.85,11.06 37.87,12.07 43.54,12.07 | 43.54,12.07 49.1,12.07 49.54,11.63 R1.1 50.7,11.64 51.04,11.3 Q2.3 | U6.28 41.68,10.21 43.54,12.07
SDA3.3V
  Top 0.254: R11.1 54.39,6.77 Q1.2
  Top 0.305: R11.1 55.37,7.63 55.37,10.09 56.42,11.14 57.61,11.14 57.91,10.84 57.91,8.65 58.36,8.2 59.41,8.2 59.59,8.38 59.59,8.39 SDA3.3V.1
SDA5V
  Top 0.254: U1.3 34.11,8.62 34.78,9.3 35.79,9.3 36.45,9.96 36.45,11.23 37.7,12.47 50.46,12.47 51.71,11.22 51.71,10.03 50.44,8.76 50.41,8.76 50.41,10.54 50.15,10.8 42.95,10.8 42.18,10.03 U6.27
  Top 0.305: R15.1 50.09,8.57 50.41,8.25 | Q1.3 50.41,8.25 | 50.41,8.76 50.41,8.25
VCC_READ
  Top 0.203: U1.16 28.49,5.47 27.5,6.46 25.7,6.46 | 25.7,6.46 23.74,6.46 R17.1 | R16.2 25.7,6.46

### Text on the board
tPlace: 0 | 1 | 2 | 3 | 4 | 5 | 6 | 7 | RESET | +5V | +5V | GND | 14 | 13 | 12 | 11 | 10 | 9 | 8 | v0.1 (15)
bPlace: SCL | 0 | 1 | 2 | 3 | 4 | 5 | 6 | 7 | SDA | COM | MOSI | +5V | +5V | +5V | RESET | SCK | MISO | COM | GND | +5V | 14 | 13 | 12 | 11 | 10 | 9 | 8